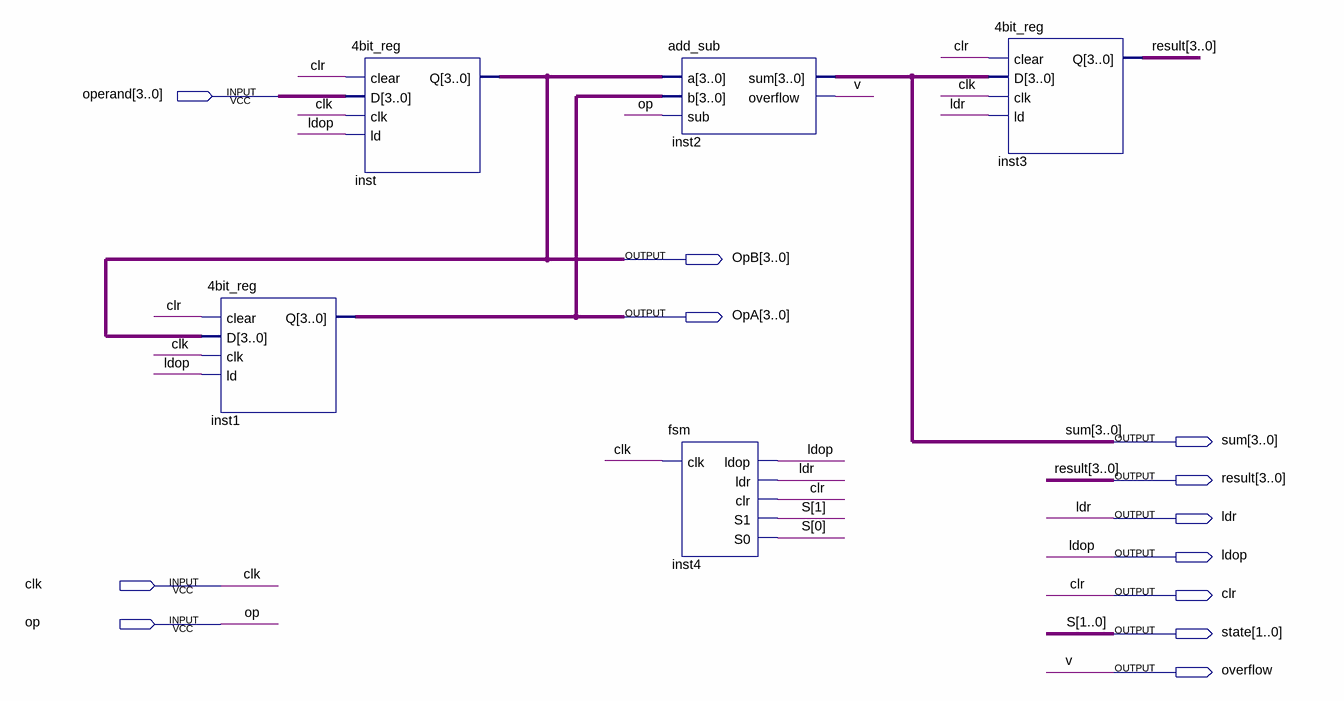
[diagram p0: schematic sheet]
// Quartus schematic qhua835_lab2.bdf as structural Verilog: 5 symbols, 12 pins
module qhua835_lab2 (
  input  [3:0] operand,
  input  clk,
  input  op,
  output [3:0] OpB,
  output [3:0] OpA,
  output [3:0] sum,
  output [3:0] result,
  output ldr,
  output ldop,
  output clr,
  output [1:0] state,
  output overflow
);

  \4bit_reg  inst1 (.clear(clr), .D(OpB), .clk(clk), .ld(ldop), .Q(OpA));
  \4bit_reg  inst (.clear(clr), .D(operand), .clk(clk), .ld(ldop), .Q(OpB));
  add_sub inst2 (.a(OpB), .b(OpA), .sub(op), .sum(sum), .overflow(overflow));
  fsm inst4 (.clk(clk), .ldop(ldop), .ldr(ldr), .clr(clr), .S1(state[1]), .S0(state[0]));
  \4bit_reg  inst3 (.clear(clr), .D(sum), .clk(clk), .ld(ldr), .Q(result));

  // Other names for the same wires on the sheet: S[1:0] = state; v = overflow
endmodule
